# EAGLE schematic MucDuino_Banana (EAGLE 6.5.0)
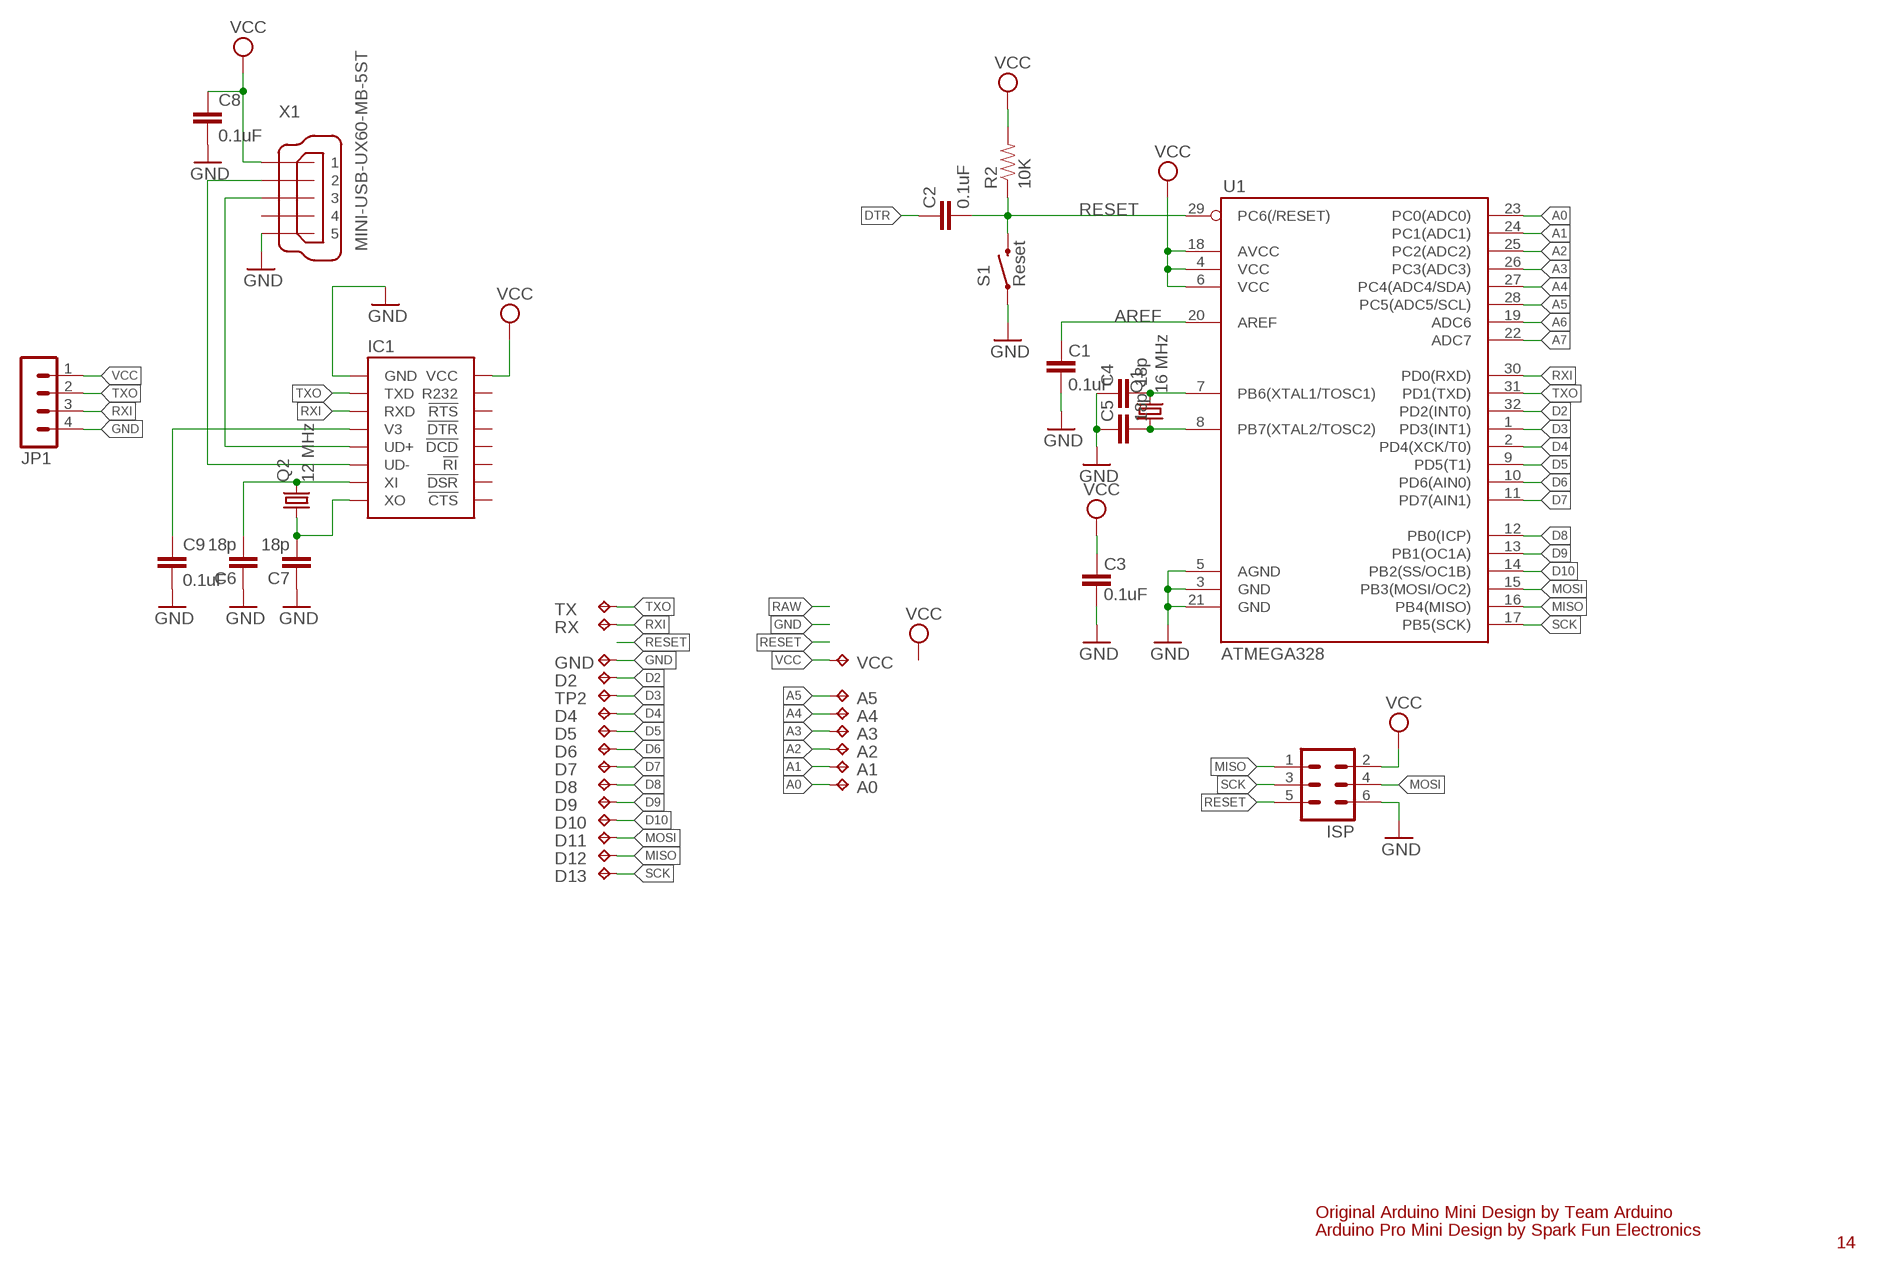
[diagram p0: schematic, sheet 1]

## Parts
A0  TPPAD1-13  [P1-13]
A1  TPPAD1-13  [P1-13]
A2  TPPAD1-13  [P1-13]
A3  TPPAD1-13  [P1-13]
A4  TPPAD1-13  [P1-13]
A5  TPPAD1-13  [P1-13]
C1  0.1uF  CAP0603-CAP  [0603-CAP]
C2  0.1uF  CAP0603-CAP  [0603-CAP]
C3  0.1uF  CAP0603-CAP  [0603-CAP]
C4  18p  CAP0603-CAP  [0603-CAP]
C5  18p  CAP0603-CAP  [0603-CAP]
C6  18p  CAP0603-CAP  [0603-CAP]
C7  18p  CAP0603-CAP  [0603-CAP]
C8  0.1uF  CAP0603-CAP  [0603-CAP]
C9  0.1uF  CAP0603-CAP  [0603-CAP]
D2  TPPAD1-13  [P1-13]
D4  TPPAD1-13  [P1-13]
D5  TPPAD1-13  [P1-13]
D6  TPPAD1-13  [P1-13]
D7  TPPAD1-13  [P1-13]
D8  TPPAD1-13  [P1-13]
D9  TPPAD1-13  [P1-13]
D10  TPPAD1-13  [P1-13]
D11  TPPAD1-13  [P1-13]
D12  TPPAD1-13  [P1-13]
D13  TPPAD1-13  [P1-13]
GND  TPPAD1-13  [P1-13]
IC1  CH340G  [SOP16-209MM]
ISP  MA03-2  [MA03-2]
JP1  MA04-1  [MA04-1]
Q1  16 MHz  CRYSTALHC49UP  [HC49UP]
Q2  12 MHz  CRYSTALHC49UP  [HC49UP]
R2  10K  RESISTOR0603-RES  [0603-RES]
RX  TPPAD1-13  [P1-13]
S1  Reset  SWITCH-MOMENTARY-2SMD-ALT01  [TACTILE-SWITCH-SMD-ALT01]
TP2  TPPAD1-13  [P1-13]
TX  TPPAD1-13  [P1-13]
U1  ATMEGA328  ATMEGA168  [TQFP32-08]
VCC  TPPAD1-13  [P1-13]
X1  MINI-USB-UX60-MB-5ST  [UX60-MB-5ST]

## Nets
A0: A0.TP U1.23(PC0(ADC0))
A1: A1.TP U1.24(PC1(ADC1))
A2: A2.TP U1.25(PC2(ADC2))
A3: A3.TP U1.26(PC3(ADC3))
A4: A4.TP U1.27(PC4(ADC4/SDA))
A5: A5.TP U1.28(PC5(ADC5/SCL))
A6: U1.19(ADC6)
A7: U1.22(ADC7)
AREF: C1.2 U1.20(AREF)
D2: D2.TP U1.32(PD2(INT0))
D3: TP2.TP U1.1(PD3(INT1))
D4: D4.TP U1.2(PD4(XCK/T0))
D5: D5.TP U1.9(PD5(T1))
D6: D6.TP U1.10(PD6(AIN0))
D7: D7.TP U1.11(PD7(AIN1))
D8: D8.TP U1.12(PB0(ICP))
D9: D9.TP U1.13(PB1(OC1A))
D10: D10.TP U1.14(PB2(SS/OC1B))
DTR: C2.2
GND [vcc]: C1.1 C3.1 C4.2 C5.2 C6.2 C7.2 C8.2 C9.2 GND.TP IC1.P$1(GND) ISP.6 JP1.4 S1.1 S1.2 U1.3(GND) U1.5(AGND) U1.21(GND) X1.5
MISO: D12.TP ISP.1 U1.16(PB4(MISO))
MOSI: D11.TP ISP.4 U1.15(PB3(MOSI/OC2))
N$1: C5.1 Q1.1 U1.8(PB7(XTAL2/TOSC2))
N$2: C4.1 Q1.2 U1.7(PB6(XTAL1/TOSC1))
N$3: C9.1 IC1.P$4(V3)
N$5: C6.1 IC1.P$7(XI) Q2.2
N$6: C7.1 IC1.P$8(XO) Q2.1
N$8: IC1.P$5(UD+) X1.3
N$9: IC1.P$6(UD-) X1.2
RESET: C2.1 ISP.5 R2.1 S1.3 S1.4 U1.29(PC6(/RESET))
RXI: IC1.P$3(RXD) JP1.3 RX.TP U1.30(PD0(RXD))
SCK: D13.TP ISP.3 U1.17(PB5(SCK))
TXO: IC1.P$2(TXD) JP1.2 TX.TP U1.31(PD1(TXD))
VCC: C3.2 C8.1 IC1.P$16(VCC) ISP.2 JP1.1 R2.2 U1.4(VCC) U1.6(VCC) U1.18(AVCC) VCC.TP X1.1
Unconnected: IC1.P$9(!CTS) IC1.P$10(!DSR) IC1.P$11(!RI) IC1.P$12(!DCD) IC1.P$13(!DTR) IC1.P$14(!RTS) IC1.P$15(R232) X1.4

## Notes on the sheet
- Original Arduino Mini Design by Team Arduino
- Arduino Pro Mini Design by Spark Fun Electronics
- 14

## Library data of the parts
A0 A1-A5 D2 D4-D13 GND RX TP2 TX VCC = testpad:TP: Test pad
C1-C9 = SparkFun:CAP: Capacitor Standard 0603 ceramic capacitor, and 0.1" leaded capacitor.
IC1 = densikit:CH340
ISP = con-lstb:MA03-2: PIN HEADER; OC_FARNELL: unknown; OC_NEWARK: unknown
JP1 = con-lstb:MA04-1: PIN HEADER; OC_FARNELL: unknown; OC_NEWARK: unknown
Q1 Q2 = crystal:CRYSTAL: CRYSTAL; OC_FARNELL: unknown; OC_NEWARK: unknown
R2 = SparkFun:RESISTOR: Resistor Basic schematic elements and footprints for 0603, 1206, and PTH resistors.
S1 = Testing:SWITCH-MOMENTARY-2: Various NO switches- pushbuttons, reed, etc
U1 = SparkFun:ATMEGA168
X1 = con-hirose:MINI-USB-: MINI USB Connector Source: http://www.hirose.co.jp/cataloge_hp/e24000019.pdf; OC_FARNELL: unknown; OC_NEWARK: unknown

## Net classes
0 default: width 0.203 mm
1 vcc: width 0.254 mm